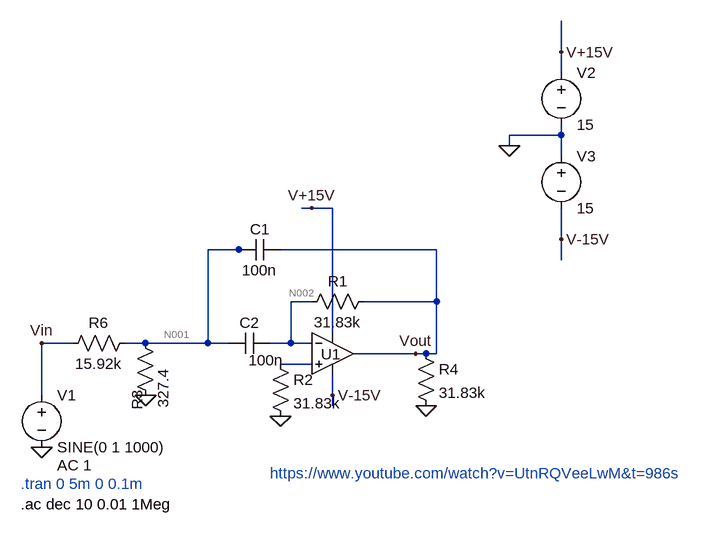
[diagram p0: schematic ActivieBPv2.asc]
ActivieBPv2.asc, the LTspice schematic file:
Version 4.1
SHEET 1 880 680
WIRE 544 -240 544 -288
WIRE 544 -208 544 -240
WIRE 544 -112 544 -128
WIRE 544 -112 464 -112
WIRE 464 -96 464 -112
WIRE 544 -80 544 -112
WIRE 160 0 144 0
WIRE 192 0 160 0
WIRE 544 48 544 0
WIRE 48 64 0 64
WIRE 64 64 48 64
WIRE 352 64 112 64
WIRE 544 80 544 48
WIRE 160 144 128 144
WIRE 352 144 352 64
WIRE 352 144 240 144
WIRE 192 192 192 0
WIRE -208 208 -256 208
WIRE -96 208 -128 208
WIRE 0 208 0 64
WIRE 0 208 -96 208
WIRE 32 208 0 208
WIRE 128 208 128 144
WIRE 128 208 96 208
WIRE 160 208 128 208
WIRE 320 224 224 224
WIRE 336 224 320 224
WIRE 352 224 352 144
WIRE 352 224 336 224
WIRE 160 240 112 240
WIRE -256 288 -256 208
WIRE 192 288 192 256
WIRE 192 304 192 288
FLAG -256 368 0
FLAG -256 208 Vin
FLAG 464 -96 0
FLAG 544 -240 V+15V
FLAG 544 48 V-15V
FLAG 160 0 V+15V
FLAG 192 288 V-15V
FLAG -96 288 0
FLAG 320 224 Vout
FLAG 112 320 0
FLAG 336 304 0
SYMBOL OpAmps\\UniversalOpAmp 192 224 R0
WINDOW 0 -18 1 Left 2
SYMATTR InstName U1
SYMBOL cap 112 48 R90
WINDOW 0 0 32 VBottom 2
WINDOW 3 32 32 VTop 2
SYMATTR InstName C1
SYMATTR Value 100n
SYMBOL cap 96 192 R90
WINDOW 0 0 32 VBottom 2
WINDOW 3 27 6 VTop 2
SYMATTR InstName C2
SYMATTR Value 100n
SYMBOL res 256 128 R90
WINDOW 0 0 56 VBottom 2
WINDOW 3 32 56 VTop 2
SYMATTR InstName R1
SYMATTR Value 31.83k
SYMBOL res -112 192 R0
WINDOW 0 3 88 VRight 2
WINDOW 3 43 55 VRight 2
SYMATTR InstName R3
SYMATTR Value 327.4
SYMBOL res -112 192 R90
WINDOW 0 0 56 VBottom 2
WINDOW 3 32 56 VTop 2
SYMATTR InstName R6
SYMATTR Value 15.92k
SYMBOL voltage -256 272 R0
WINDOW 123 24 124 Left 2
WINDOW 39 0 0 Left 0
SYMATTR Value2 AC 1
SYMATTR InstName V1
SYMATTR Value SINE(0 1 1000)
SYMBOL voltage 544 -224 R0
WINDOW 123 0 0 Left 0
WINDOW 39 0 0 Left 0
SYMATTR InstName V2
SYMATTR Value 15
SYMBOL voltage 544 -96 R0
WINDOW 123 0 0 Left 0
WINDOW 39 0 0 Left 0
SYMATTR InstName V3
SYMATTR Value 15
SYMBOL res 96 224 R0
SYMATTR InstName R2
SYMATTR Value 31.83k
SYMBOL res 320 208 R0
SYMATTR InstName R4
SYMATTR Value 31.83k
TEXT -288 424 Left 2 ;.tran 0 5m 0 0.1m
TEXT -288 456 Left 2 !.ac dec 10 0.01 1Meg
TEXT 96 408 Left 2 ;https://www.youtube.com/watch?v=UtnRQVeeLwM&t=986s

The netlist it stands for:
* ActivieBPv2.asc
X§U1 N003 N002 V+15V V-15V Vout level1 Avol=1Meg GBW=10Meg Vos=0 En=0 Enk=0 In=0 Ink=0 Rin=500Meg  ; pins In+ In- V+ V- OUT
C1 Vout N001 100n
C2 N002 N001 100n
R1 Vout N002 31.83k
R3 N001 0 327.4
R6 N001 Vin 15.92k
V1 Vin 0 SINE(0 1 1000) AC 1
V2 V+15V 0 15
V3 0 V-15V 15
R2 N003 0 31.83k
R4 Vout 0 31.83k
* .tran 0 5m 0 0.1m
.ac dec 10 0.01 1Meg
* https://www.youtube.com/watch?v=UtnRQVeeLwM&t=986s
.lib UniversalOpAmp1.lib
.backanno
.end

* Results of the author's LTspice run, read from the files saved beside the schematic
* Operating Point, zero values left out:
*   V(v+15v) = 15 V
*   V(v-15v) = -15 V
*   I(V2) = -30 nA
*   I(V3) = -30 nA
*   Ix(u1:3) = 30 nA
*   Ix(u1:4) = -30 nA
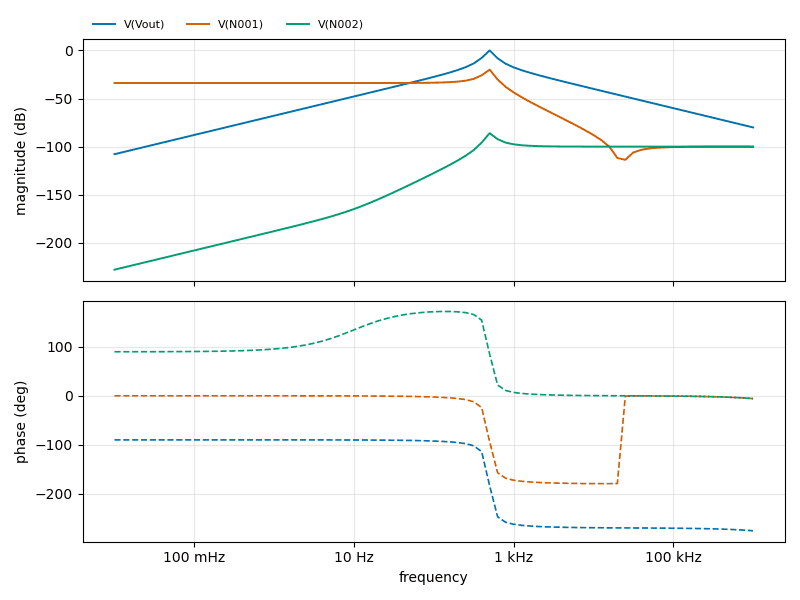
[diagram p1: AC Analysis of ActivieBPv2.asc, plotted from the saved traces]
* AC Analysis, 1 run:
*   V(Vout): -107.89 dB at 10 mHz, -80.05 dB at 1 MHz, peak -0.02 dB at 501.2 Hz, 3 dB below the peak at 458.6 Hz and 545.3 Hz
*   V(N001): -33.91 dB at 10 mHz, -100.05 dB at 1 MHz, peak -20.05 dB at 501.2 Hz, 3 dB below the peak at 444.7 Hz and 536.3 Hz
*   V(N002): -227.89 dB at 10 mHz, -100.05 dB at 1 MHz, peak -86.02 dB at 501.2 Hz, 3 dB below the peak at 467 Hz and 560.2 Hz